# EAGLE design sensor (EAGLE 5.04)
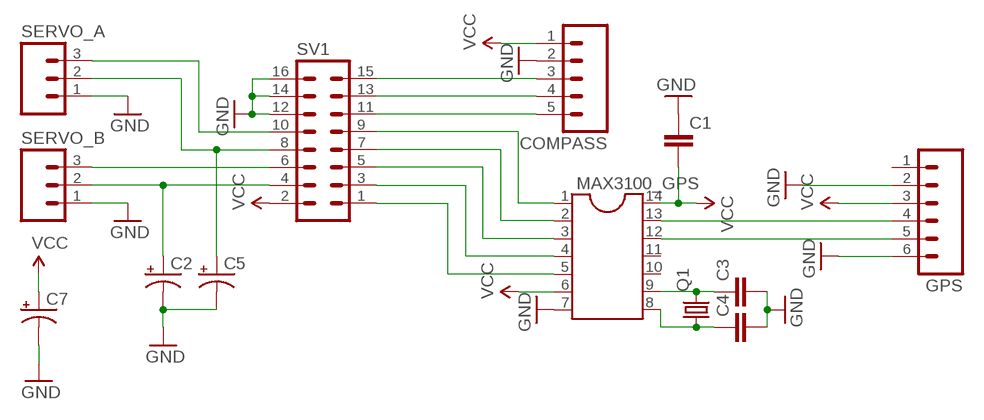
[diagram p0: schematic, sheet 1]

## Parts
C1  CAPPTH  [CAP-PTH-SMALL]
C2  CAP_POLPTH1  [CPOL-RADIAL-100UF-25V]
C3  CAPPTH  [CAP-PTH-SMALL]
C4  CAPPTH  [CAP-PTH-SMALL]
C5  CAP_POLPTH1  [CPOL-RADIAL-100UF-25V]
C7  CAP_POLPTH2  [CPOL-RADIAL-10UF-25V]
COMPASS  M05PTH  [1X05]
GPS  M06SIP  [1X06]
MAX3100_GPS  DIL14S  [SOCKET-14]
Q1  CRYSTALHC49US  [HC49US]
SERVO_A  M03PTH  [1X03]
SERVO_B  M03PTH  [1X03]
SV1  MA08-2  [MA08-2]

## Nets
GND: C1.1 C2.2(-) C3.2 C4.2 C5.2(-) C7.2(-) COMPASS.2 GPS.2 GPS.6 MAX3100_GPS.7 SERVO_A.1 SERVO_B.1 SV1.12 SV1.14 SV1.16
N$1: C3.1 MAX3100_GPS.9 Q1.2
N$2: C4.1 MAX3100_GPS.8 Q1.1
N$3: GPS.4 MAX3100_GPS.13
N$4: GPS.5 MAX3100_GPS.12
N$5: COMPASS.3 SV1.15
N$6: COMPASS.4 SV1.13
N$7: COMPASS.5 SV1.11
N$8: MAX3100_GPS.1 SV1.9
N$9: MAX3100_GPS.2 SV1.7
N$10: MAX3100_GPS.3 SV1.5
N$11: MAX3100_GPS.4 SV1.3
N$12: MAX3100_GPS.5 SV1.1
N$13: SERVO_A.3 SV1.10
N$14: SERVO_B.3 SV1.6
N$15: C2.1(+) SERVO_B.2 SV1.4
N$16: C5.1(+) SERVO_A.2 SV1.8
VCC: C1.2 C7.1(+) COMPASS.1 GPS.3 MAX3100_GPS.6 MAX3100_GPS.14 SV1.2
Unconnected: GPS.1 MAX3100_GPS.10 MAX3100_GPS.11

## Library data of the parts
C1 C3 C4 = SparkFun:CAP: Capacitor Standard 0603 ceramic capacitor, and 0.1" leaded capacitor.
C2 C5 C7 = SparkFun:CAP_POL: Capacitor Polarized These are standard SMD and PTH capacitors. Normally 10uF, 47uF, and 100uF in electrolytic and tantalum varieties. Always verify the external diameter of the through hole cap, it varies with capacity, voltage, and manufacturer. The EIA devices should be standard.
COMPASS = SparkFun:M05: Header 5 Standard 5-pin 0.1" header. Use with straight break away headers (SKU : PRT-00116), right angle break away headers (PRT-00553), swiss pins (PRT-00743), machine pins (PRT-00117), and female headers (PRT-00115). Molex polarized connector foot print use with SKU : PRT-08230 with associated crimp pins and housings.
GPS = SparkFun:M06: Header 6 Standard 6-pin 0.1" header. Use with straight break away headers (SKU : PRT-00116), right angle break away headers (PRT-00553), swiss pins (PRT-00743), machine pins (PRT-00117), and female headers (PRT-00115). Molex polarized connector foot print use with SKU : PRT-08094 with associated crimp pins and housings. NOTES ON THE VARIANTS LOCK and LOCK_LONGPADS... This footprint was designed to help hold the alignment of a through-hole component (i.e. 6-pin header) while soldering it into place. You may notice that each hole has been shifted either up or down by 0.005 of an inch from it's more standard position (which is a perfectly straight line). This slight alteration caused the pins (the squares in the middle) to touch the edges of the holes. Because they are alternating, it causes a "brace" to hold the component in place. 0.005 has proven to be the perfect amount of "off-center" position when using our standard breakaway headers. Although looks a little odd when you look at the bare footprint, once you have a header in there, the alteration is very hard to notice. Also, if you push a header all the way into place, it is covered up entirely on the bottom side. This idea of altering the position of holes to aid alignment will be further integrated into the Sparkfun Library for other footprints. It can help hold any component with 3 or more connection pins.
MAX3100_GPS = ic-package:DIL14: Dual In Line / Socket
Q1 = SparkFun:CRYSTAL: Crystals Various standard crystals. Proven footprints. Spark Fun Electronics SKU : COM-00534
SERVO_A SERVO_B = SparkFun:M03: Header 3 Standard 3-pin 0.1" header. Use with straight break away headers (SKU : PRT-00116), right angle break away headers (PRT-00553), swiss pins (PRT-00743), machine pins (PRT-00117), and female headers (PRT-00115). Molex polarized connector foot print use with SKU : PRT-08232 with associated crimp pins and housings.
SV1 = con-lstb:MA08-2: PIN HEADER

## Board
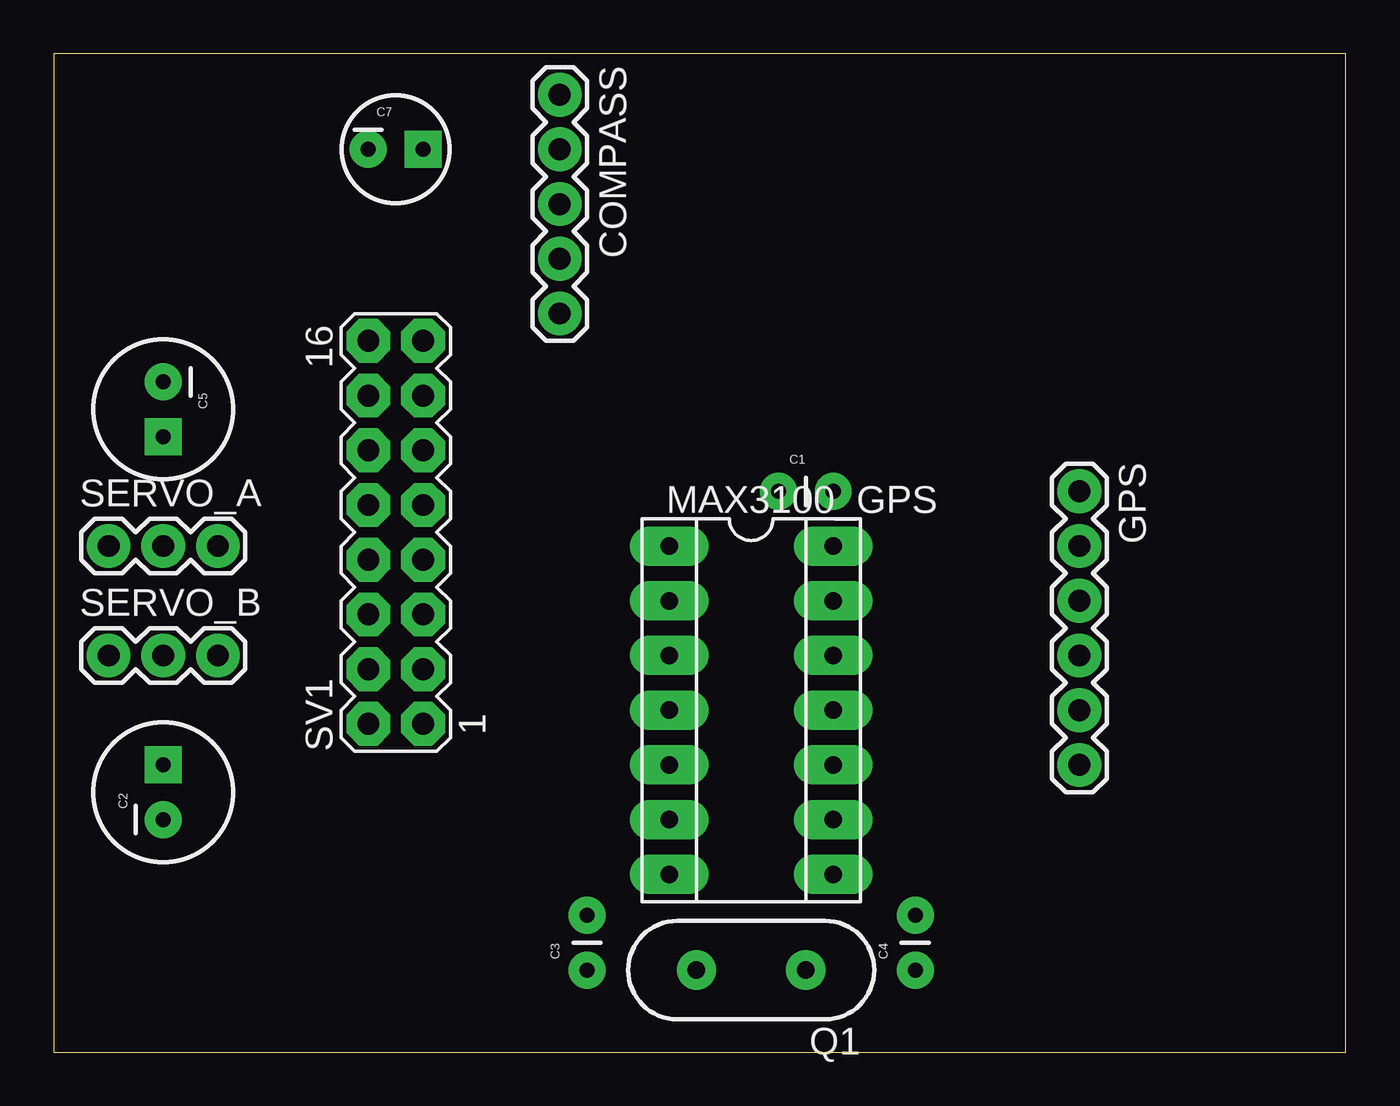
[diagram p1: board, top side]
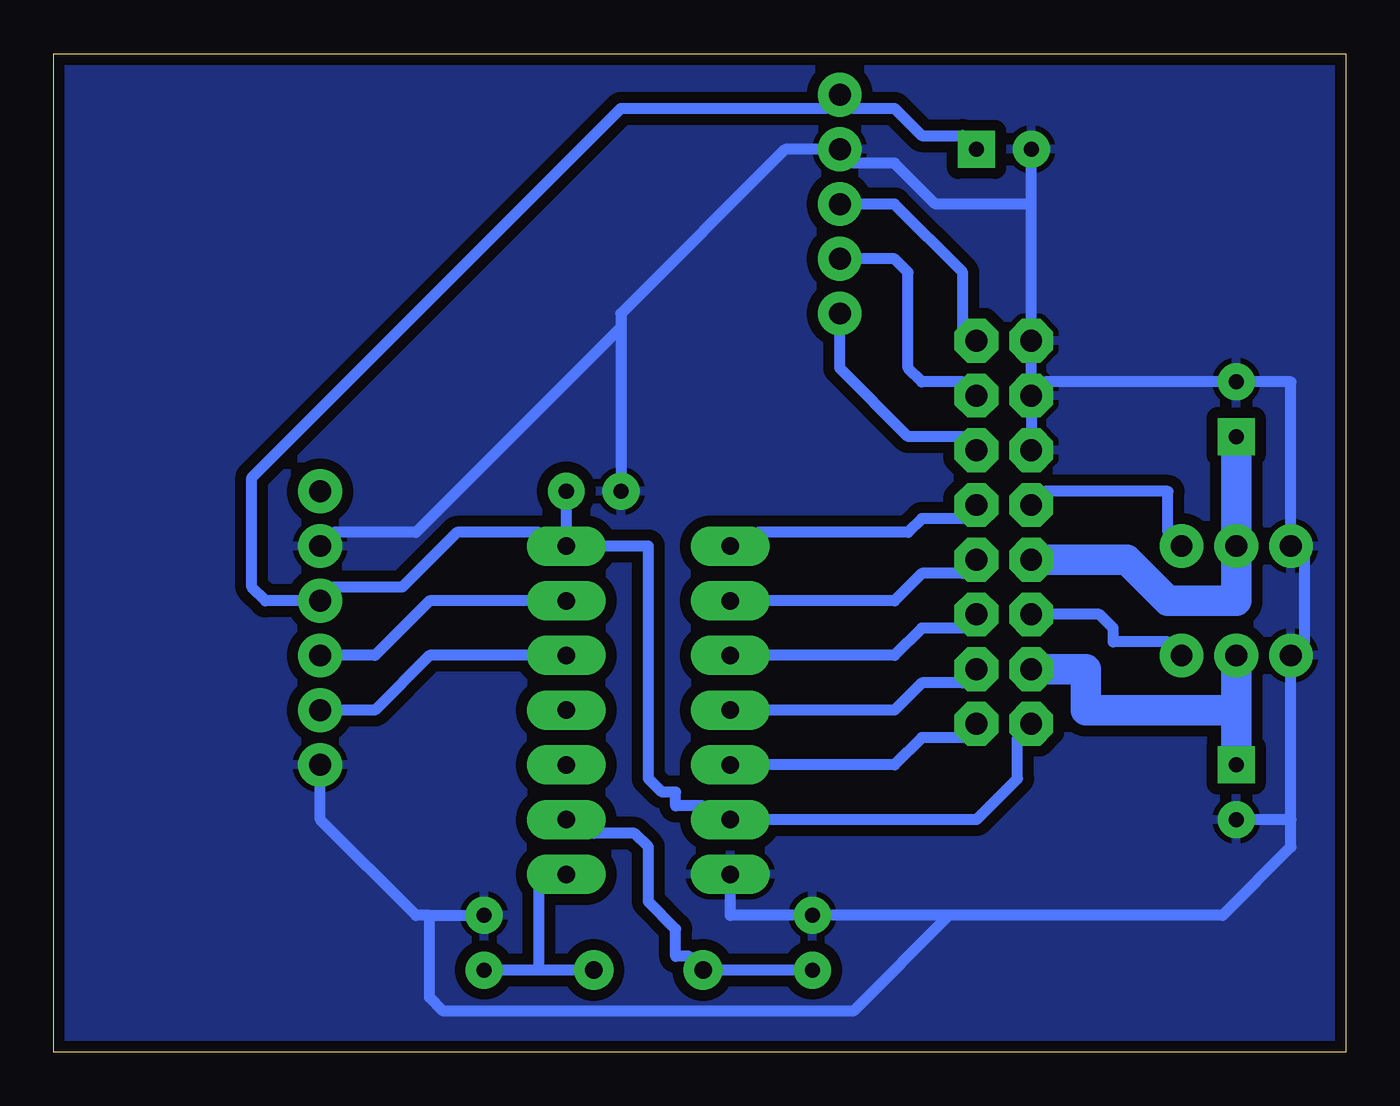
[diagram p2: board, bottom side, seen from below]

Size 59.99 x 46.34 mm. Coordinates in mm from the lower left corner, seen from the top.
Outline: 0,0 59.99,0 59.99,46.34 0,46.34 0,0
Copper layers (1*16): Top 0mm / dielectric 1.5mm / Bottom 0.035mm
Design rules "default *": minimum track width 20mil, minimum drill 21mil, track to track 20mil, track to pad 20mil, pad to pad 10mil, via to via 8mil, smd to smd 8mil, copper to edge 20mil, drill to drill 40mil, minimum pad ring 20mil, minimum via ring 8mil, stop-mask expansion 4mil, vias tented up to drill 0mil, thermal gap 10mil

### Footprints (pad centres in the part's own frame; a part is rotated, then mirrored left to right if it is on the bottom)
CAP-PTH-SMALL = drill 0.7 round: 1 0,0; 2 2.54,0
CPOL-RADIAL-100UF-25V = drill 0.7 square: 1 1.27,0 | drill 0.7 round: 2 -1.27,0
CPOL-RADIAL-10UF-25V = drill 0.7 square: 1 1.27,0 | drill 0.7 round: 2 -1.27,0
1X05 = drill 1.016 round: 1 0,0; 2 2.54,0; 3 5.08,0; 4 7.62,0; 5 10.16,0
1X06 = drill 1.016 round: 1 0,0; 2 2.54,0; 3 5.08,0; 4 7.62,0; 5 10.16,0; 6 12.7,0
SOCKET-14 = drill 0.813 long: 1 -7.62,-3.81; 2 -5.08,-3.81; 3 -2.54,-3.81; 4 0,-3.81; 5 2.54,-3.81; 6 5.08,-3.81; 7 7.62,-3.81; 8 7.62,3.81; 9 5.08,3.81; 10 2.54,3.81; 11 0,3.81; 12 -2.54,3.81; 13 -5.08,3.81; 14 -7.62,3.81
HC49US = drill 0.813 round: 1 -2.54,0; 2 2.54,0
1X03 = drill 1.016 round: 1 0,0; 2 2.54,0; 3 5.08,0
MA08-2 = drill 1.016 octagon: 1 -8.89,-1.27; 2 -8.89,1.27; 3 -6.35,-1.27; 4 -6.35,1.27; 5 -3.81,-1.27; 6 -3.81,1.27; 7 -1.27,-1.27; 8 -1.27,1.27; 9 1.27,-1.27; 10 1.27,1.27; 11 3.81,-1.27; 12 3.81,1.27; 13 6.35,-1.27; 14 6.35,1.27; 15 8.89,-1.27; 16 8.89,1.27

### Placement (x,y rotation side)
C1  33.66,26.04 0 top
C2  5.08,12.06 90 top
C3  24.77,3.81 90 top
C4  40.01,3.81 90 top
C5  5.08,29.84 270 top
C7  15.88,41.91 0 top
COMPASS  23.5,44.45 270 top
GPS  47.62,26.04 270 top
MAX3100_GPS  32.38,15.88 270 top
Q1  32.38,3.81 180 top
SERVO_A  2.54,23.5 0 top
SERVO_B  2.54,18.41 0 top
SV1  15.88,24.13 90 top

### Tracks (layer width: path | path; a pad name or v marks a point on that pad's centre or on a via)
GND
  Bottom 0.508: 33.66,33.66 33.66,34.29 26.04,41.91 COMPASS.2 22.86,41.27 20.95,41.27 19.05,39.37 14.61,39.37 | 33.66,33.66 C1.1 | 33.66,33.66 43.18,24.13 46.99,24.13 GPS.2 | 14.61,39.37 C7.2 | 14.61,39.37 SV1.16 SV1.14 | SV1.14 13.97,31.11 C5.2 2.54,31.11 SERVO_A.1 1.91,22.86 1.91,19.05 SERVO_B.1 2.54,10.79 | SV1.14 SV1.12 | 42.55,6.35 43.18,6.35 47.62,10.79 GPS.6 | 42.55,6.35 C4.2 | MAX3100_GPS.7 28.57,6.35 C3.2 18.41,6.35 | 2.54,10.79 C2.2 | 18.41,6.35 5.71,6.35 2.54,9.53 2.54,10.79 | 42.55,6.35 42.55,2.54 41.91,1.91 22.86,1.91 18.41,6.35
  pour Bottom: 0,46.35 59.69,46.35 59.69,0 0,0
N$1
  Bottom 0.508: C3.1 Q1.2 30.48,4.45 31.11,4.45 31.11,5.71 32.38,6.99 32.38,9.53 33.02,10.16 34.92,10.16 MAX3100_GPS.9
N$2
  Bottom 0.508: 37.47,3.81 C4.1 | Q1.1 37.47,3.81 | 37.47,3.81 37.47,7.62 MAX3100_GPS.8
N$3
  Bottom 0.508: MAX3100_GPS.13 42.55,20.95 45.09,18.41 GPS.4
N$4
  Bottom 0.508: MAX3100_GPS.12 42.55,18.41 45.09,15.88 GPS.5
N$5
  Bottom 0.508: SV1.15 17.78,33.66 17.78,36.2 20.95,39.37 COMPASS.3
N$6
  Bottom 0.508: SV1.13 17.78,31.11 19.68,31.11 20.32,31.75 20.32,36.2 20.95,36.83 COMPASS.4
N$7
  Bottom 0.508: SV1.11 17.78,28.57 20.32,28.57 23.5,31.75 COMPASS.5
N$8
  Bottom 0.508: MAX3100_GPS.1 27.3,24.13 20.32,24.13 19.68,24.77 17.78,24.77 SV1.9
N$9
  Bottom 0.508: MAX3100_GPS.2 20.95,20.95 19.68,22.23 17.78,22.23 SV1.7
N$10
  Bottom 0.508: MAX3100_GPS.3 20.95,18.41 19.68,19.68 17.78,19.68 SV1.5
N$11
  Bottom 0.508: MAX3100_GPS.4 20.95,15.88 19.68,17.14 17.78,17.14 SV1.3
N$12
  Bottom 0.508: MAX3100_GPS.5 20.95,13.34 19.68,14.61 17.78,14.61 SV1.1
N$13
  Bottom 0.508: SERVO_A.3 8.26,24.13 8.26,26.04 13.97,26.04 SV1.10
N$14
  Bottom 0.508: SERVO_B.3 8.26,19.05 10.79,19.05 10.79,19.68 11.43,20.32 SV1.6
N$15
  Bottom 1.422: C2.1 5.08,15.88 | 5.08,15.88 SERVO_B.2 | 5.08,15.88 12.06,15.88 12.06,17.78 SV1.4
N$16
  Bottom 1.422: C5.1 SERVO_A.2 5.08,20.95 8.26,20.95 10.16,22.86 SV1.8
VCC
  Bottom 0.508: SV1.2 15.24,14.61 15.24,12.7 17.14,10.79 MAX3100_GPS.6 29.84,11.43 31.11,11.43 31.11,12.06 31.75,12.06 32.38,12.7 32.38,23.5 MAX3100_GPS.14 | C7.1 17.78,42.55 19.68,42.55 20.95,43.81 22.86,43.81 COMPASS.1 24.13,43.81 33.66,43.81 50.8,26.67 50.8,21.59 50.16,20.95 GPS.3 46.99,21.59 43.81,21.59 41.27,24.13 37.47,24.13 MAX3100_GPS.14 | MAX3100_GPS.14 C1.2